# Altium schematic sheet StormNet_Lights.SchDoc
size A
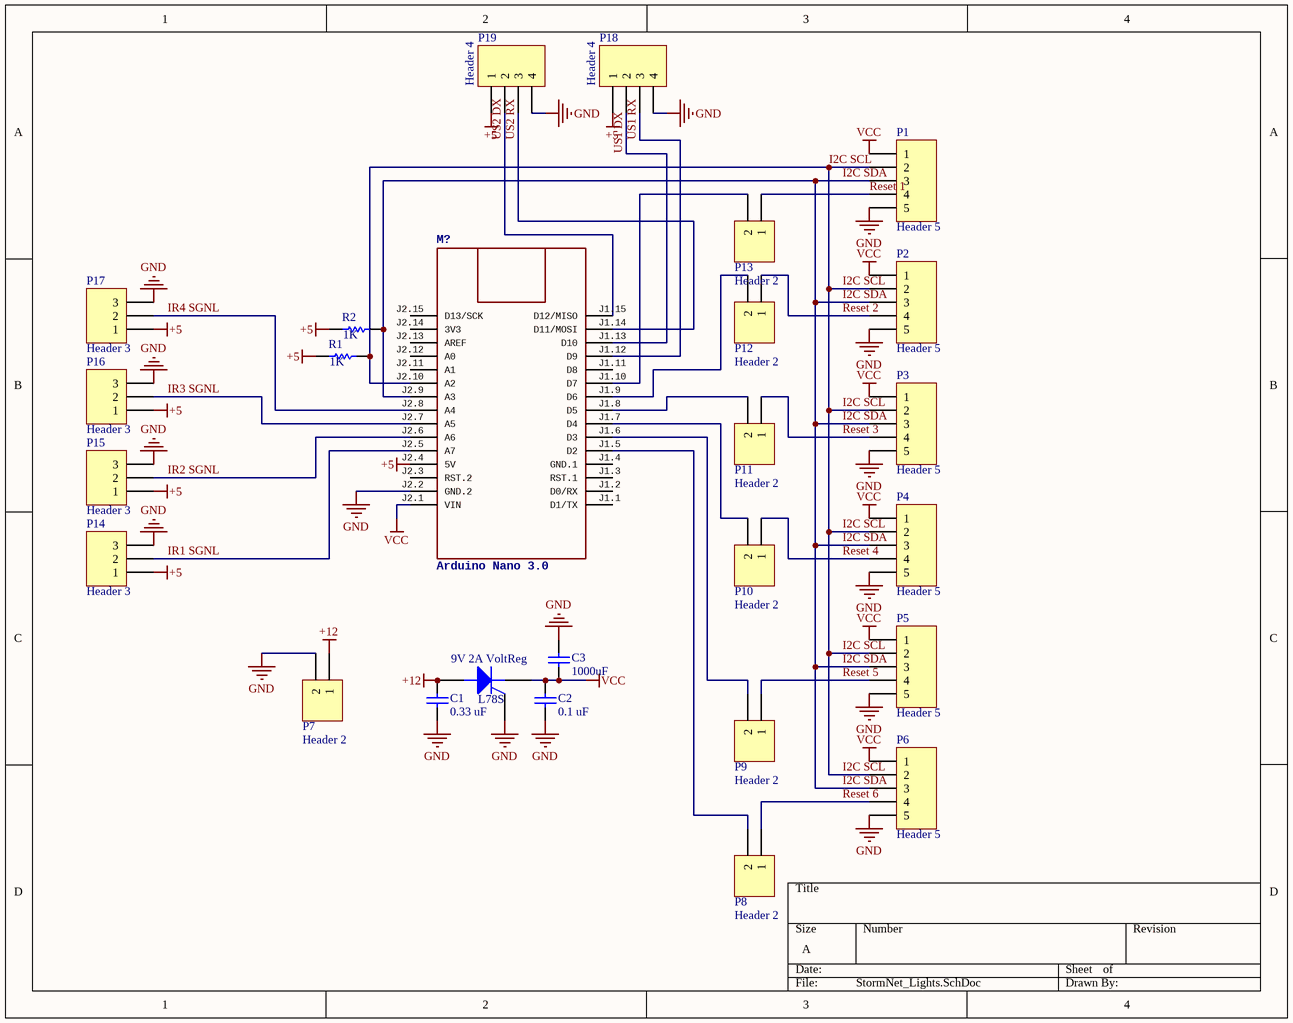
[diagram p0: StormNet_Lights.SchDoc]

## Parts
9V_2A_VoltReg  L78S  [TO-220-AB]
C1  0.33 uF  [RAD-0.3]
C2  0.1 uF  [RAD-0.3]
C3  1000uF  [RAD-0.3]
M?  Arduino Nano 3.0  [ARDUINO-NANO-3.0]
P1  Header 5  [HDR1X5]
P2  Header 5  [HDR1X5]
P3  Header 5  [HDR1X5]
P4  Header 5  [HDR1X5]
P5  Header 5  [HDR1X5]
P6  Header 5  [HDR1X5]
P7  Header 2  [HDR1X2]
P8  Header 2  [HDR1X2]
P9  Header 2  [HDR1X2]
P10  Header 2  [HDR1X2]
P11  Header 2  [HDR1X2]
P12  Header 2  [HDR1X2]
P13  Header 2  [HDR1X2]
P14  Header 3  [HDR1X3]
P15  Header 3  [HDR1X3]
P16  Header 3  [HDR1X3]
P17  Header 3  [HDR1X3]
P18  Header 4  [HDR1X4]
P19  Header 4  [HDR1X4]
R1  value 1K  [AXIAL-0.3]
R2  value 1K  [AXIAL-0.3]

## Nets
+5: M?.J2.4(5V) P14.1 P15.1 P16.1 P17.1 P18.1 P19.1 R1.1 R2.1
+12: 9V_2A_VoltReg.1(A) C1.2 P7.1
GND: 9V_2A_VoltReg.2(G) C1.1 C2.1 C3.1 M?.J2.2(GND.2) P1.5 P2.5 P3.5 P4.5 P5.5 P6.5 P7.2 P14.3 P15.3 P16.3 P17.3 P18.4 P19.4
VCC: 9V_2A_VoltReg.3(K) C2.2 C3.2 M?.J2.1(VIN) P1.1 P2.1 P3.1 P4.1 P5.1 P6.1
I2C SCL: M?.J2.10(A2) P1.2 P2.2 P3.2 P4.2 P5.2 P6.2 R1.2
I2C SDA: M?.J2.9(A3) P1.3 P2.3 P3.3 P4.3 P5.3 P6.3 R2.2
IR1 SGNL: M?.J2.5(A7) P14.2
IR2 SGNL: M?.J2.6(A6) P15.2
IR3 SGNL: M?.J2.7(A5) P16.2
IR4 SGNL: M?.J2.8(A4) P17.2
Reset 1: P1.4 P13.1
Reset 2: P2.4 P12.1
Reset 3: P3.4 P11.1
Reset 4: P4.4 P10.1
Reset 5: P5.4 P9.1
Reset 6: P6.4 P8.1
US1 DX: M?.J1.13(D10) P18.2
US1 RX: M?.J1.12(D9) P18.3
US2 DX: M?.J1.15(D12/MISO) P19.2
US2 RX: M?.J1.14(D11/MOSI) P19.3
NetM?_J1.5: M?.J1.5(D2) P8.2
NetM?_J1.6: M?.J1.6(D3) P9.2
NetM?_J1.7: M?.J1.7(D4) P10.2
NetM?_J1.8: M?.J1.8(D5) P11.2
NetM?_J1.9: M?.J1.9(D6) P12.2
NetM?_J1.10: M?.J1.10(D7) P13.2

Not connected (* = marked no-connect by the designer): M? J1.1(D1/TX) J1.2(D0/RX) J1.3(RST.1) J1.4(GND.1) J1.11(D8) J2.3(RST.2) J2.11(A1) J2.12(A0) J2.13(AREF) J2.14(3V3) J2.15(D13/SCK)

## Library data of the parts
9V_2A_VoltReg = SCR: Silicon Controlled Rectifier; Published: 8-Jun-2000; LatestRevisionDate: 17-Jul-2002; LatestRevisionNote: Re-released for DXP Platform.; PackageReference: TO-220-AB; Publisher: Altium Limited; Code_JEDEC: TO-220-AB
C1-C3 = Cap: Capacitor; Published: 8-Jun-2000; LatestRevisionDate: 17-Jul-2002; LatestRevisionNote: Re-released for DXP Platform.; PackageReference: RAD-0.3; Publisher: Altium Limited; PackageDescription: Radial Cap, Thru-Hole; 2 Leads; 0.3 in Pin Spacing
M? = ARDUINO-NANO-3.0
P1-P6 = Header 5: Header, 5-Pin; LatestRevisionDate: 17-Jul-2002; LatestRevisionNote: Re-released for DXP Platform.; Publisher: Altium Limited
P7-P13 = Header 2: Header, 2-Pin; LatestRevisionDate: 17-Jul-2002; LatestRevisionNote: Re-released for DXP Platform.; Publisher: Altium Limited
P14-P17 = Header 3: Header, 3-Pin; LatestRevisionDate: 17-Jul-2002; LatestRevisionNote: Re-released for DXP Platform.; Publisher: Altium Limited
P18 P19 = Header 4: Header, 4-Pin; LatestRevisionDate: 17-Jul-2002; LatestRevisionNote: Re-released for DXP Platform.; Publisher: Altium Limited
R1 R2 = Res1: Resistor; Published: 8-Jun-2000; LatestRevisionDate: 17-Jul-2002; LatestRevisionNote: Re-released for DXP Platform.; PackageReference: AXIAL-0.3; Publisher: Altium Limited; PackageDescription: Axial Device, Thru-Hole; 2 Leads; 0.3 in Pin Spacing